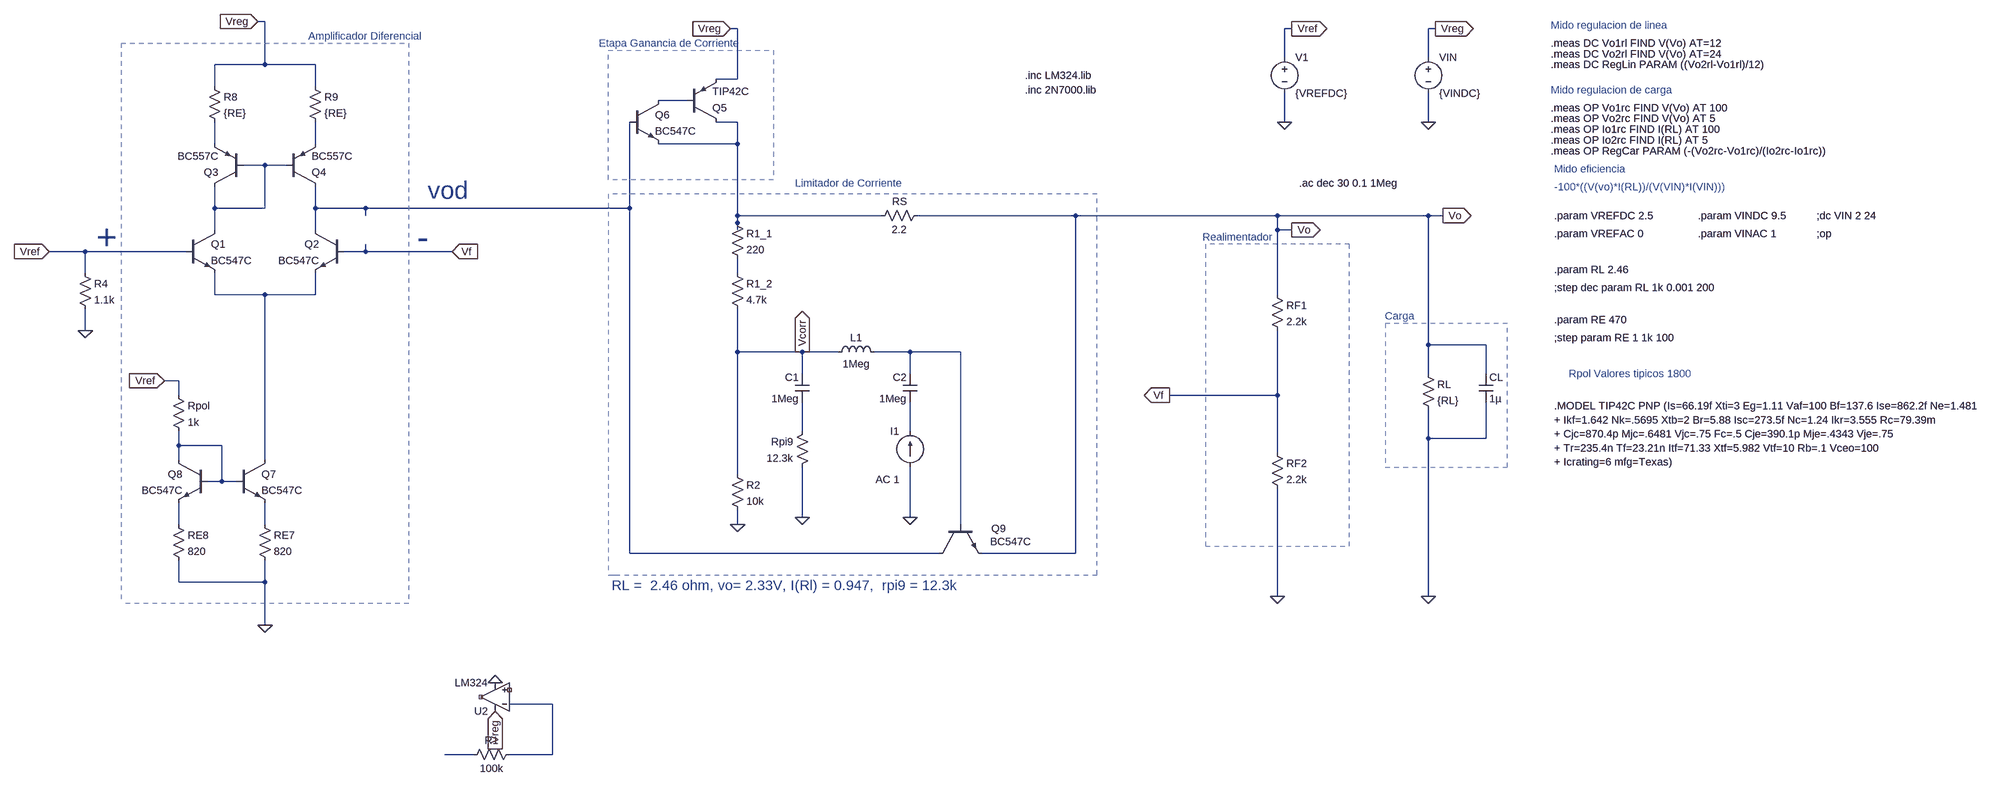
[diagram p0: schematic Ganancia de Lazo de Correo.asc]
Ganancia de Lazo de Correo.asc, the LTspice schematic file:
Version 4
SHEET 1 4240 1456
WIRE 208 -224 192 -224
WIRE 1328 -208 1312 -208
WIRE 2608 -208 2592 -208
WIRE 2928 -208 2912 -208
WIRE 2592 -144 2592 -208
WIRE 2912 -144 2912 -208
WIRE 208 -128 208 -224
WIRE 208 -128 96 -128
WIRE 320 -128 208 -128
WIRE 1328 -96 1328 -208
WIRE 1328 -96 1280 -96
WIRE 96 -80 96 -128
WIRE 320 -80 320 -128
WIRE 1216 -48 1152 -48
WIRE 1328 0 1280 0
WIRE 2592 0 2592 -64
WIRE 2912 0 2912 -64
WIRE 96 48 96 0
WIRE 320 48 320 0
WIRE 1328 48 1328 0
WIRE 1328 48 1152 48
WIRE 208 96 160 96
WIRE 256 96 208 96
WIRE 96 192 96 144
WIRE 208 192 208 96
WIRE 208 192 96 192
WIRE 320 192 320 144
WIRE 432 192 320 192
WIRE 1088 192 1088 0
WIRE 1088 192 432 192
WIRE 432 208 432 192
WIRE 1328 208 1328 48
WIRE 1648 208 1328 208
WIRE 2080 208 1728 208
WIRE 2576 208 2080 208
WIRE 2912 208 2576 208
WIRE 2944 208 2912 208
WIRE 1328 224 1328 208
WIRE 96 240 96 192
WIRE 320 240 320 192
WIRE 1328 240 1328 224
WIRE 2576 240 2576 208
WIRE 2608 240 2576 240
WIRE -192 288 -272 288
WIRE 32 288 -192 288
WIRE 432 288 432 272
WIRE 432 288 384 288
WIRE 624 288 432 288
WIRE -192 336 -192 288
WIRE 1328 336 1328 304
WIRE 96 384 96 336
WIRE 208 384 96 384
WIRE 320 384 320 336
WIRE 320 384 208 384
WIRE 2576 384 2576 240
WIRE -192 464 -192 416
WIRE 2912 496 2912 208
WIRE 3040 496 2912 496
WIRE 1328 512 1328 416
WIRE 1472 512 1328 512
WIRE 1552 512 1472 512
WIRE 1712 512 1632 512
WIRE 1824 512 1712 512
WIRE 1472 560 1472 512
WIRE 1712 560 1712 512
WIRE 2912 560 2912 496
WIRE 3040 560 3040 496
WIRE 16 576 -16 576
WIRE 16 608 16 576
WIRE 2576 608 2576 464
WIRE 2576 608 2336 608
WIRE 1472 688 1472 624
WIRE 1712 688 1712 624
WIRE 2912 704 2912 640
WIRE 3040 704 3040 624
WIRE 3040 704 2912 704
WIRE 16 720 16 688
WIRE 112 720 16 720
WIRE 2576 736 2576 608
WIRE 16 752 16 720
WIRE 208 752 208 384
WIRE 1328 784 1328 512
WIRE 112 800 112 720
WIRE 112 800 80 800
WIRE 144 800 112 800
WIRE 1472 880 1472 768
WIRE 1712 880 1712 768
WIRE 16 896 16 848
WIRE 208 896 208 848
WIRE 1328 896 1328 864
WIRE 1824 896 1824 512
WIRE 1088 960 1088 192
WIRE 1776 960 1088 960
WIRE 2080 960 2080 208
WIRE 2080 960 1872 960
WIRE 16 1024 16 976
WIRE 208 1024 208 976
WIRE 208 1024 16 1024
WIRE 2576 1056 2576 816
WIRE 2912 1056 2912 704
WIRE 208 1120 208 1024
WIRE 848 1296 752 1296
WIRE 672 1408 608 1408
WIRE 848 1408 848 1296
WIRE 848 1408 752 1408
FLAG 2944 208 Vo
IOPIN 2944 208 Out
FLAG 2608 -208 Vref
IOPIN 2608 -208 Out
FLAG 2336 608 Vf
IOPIN 2336 608 Out
FLAG 2592 0 0
FLAG 2928 -208 Vreg
IOPIN 2928 -208 Out
FLAG 2912 1056 0
FLAG 2576 1056 0
FLAG -272 288 Vref
IOPIN -272 288 In
FLAG -16 576 Vref
IOPIN -16 576 In
FLAG 2912 0 0
FLAG 1312 -208 Vreg
IOPIN 1312 -208 In
FLAG 1328 896 0
FLAG -192 464 0
FLAG 192 -224 Vreg
IOPIN 192 -224 In
FLAG 208 1120 0
FLAG 2608 240 Vo
IOPIN 2608 240 Out
FLAG 720 1248 0
FLAG 720 1312 Vreg
IOPIN 720 1312 In
FLAG 624 288 Vf
IOPIN 624 288 In
FLAG 1472 512 Vcorr
IOPIN 1472 512 Out
FLAG 1472 880 0
FLAG 1712 880 0
DATAFLAG 16 288 ""
DATAFLAG 368 192 ""
DATAFLAG 112 192 ""
DATAFLAG 320 32 ""
SYMBOL pnp 1216 0 M180
SYMATTR InstName Q5
SYMATTR Value TIP42C
SYMBOL npn 1088 -48 R0
SYMATTR InstName Q6
SYMATTR Value BC547C
SYMBOL res 2560 368 R0
SYMATTR InstName RF1
SYMATTR Value 2.2k
SYMBOL res 2560 720 R0
SYMATTR InstName RF2
SYMATTR Value 2.2k
SYMBOL res 2896 544 R0
SYMATTR InstName RL
SYMATTR Value {RL}
SYMBOL voltage 2592 -160 R0
WINDOW 123 24 124 Left 2
WINDOW 39 0 0 Left 0
SYMATTR InstName V1
SYMATTR Value {VREFDC}
SYMBOL res 80 -96 R0
SYMATTR InstName R8
SYMATTR Value {RE}
SYMBOL res 304 -96 R0
SYMATTR InstName R9
SYMATTR Value {RE}
SYMBOL cap 3024 560 R0
SYMATTR InstName CL
SYMATTR Value 1µ
SYMBOL voltage 2912 -160 R0
WINDOW 123 24 124 Left 2
WINDOW 39 0 0 Left 0
SYMATTR InstName VIN
SYMATTR Value {VINDC}
SYMBOL npn 144 752 R0
SYMATTR InstName Q7
SYMATTR Value BC547C
SYMBOL npn 80 752 M0
SYMATTR InstName Q8
SYMATTR Value BC547C
SYMBOL res 0 592 R0
SYMATTR InstName Rpol
SYMATTR Value 1k
SYMBOL npn 1776 896 M90
WINDOW 0 9 117 VRight 2
WINDOW 3 38 114 VRight 2
SYMATTR InstName Q9
SYMATTR Value BC547C
SYMBOL res 1744 192 R90
WINDOW 0 0 56 VBottom 2
WINDOW 3 32 56 VTop 2
SYMATTR InstName RS
SYMATTR Value 2.2
SYMBOL res 1312 768 R0
SYMATTR InstName R2
SYMATTR Value 10k
SYMBOL res 1312 208 R0
SYMATTR InstName R1_1
SYMATTR Value 220
SYMBOL res -208 320 R0
SYMATTR InstName R4
SYMATTR Value 1.1k
SYMBOL res 192 880 R0
SYMATTR InstName RE7
SYMATTR Value 820
SYMBOL res 0 880 R0
SYMATTR InstName RE8
SYMATTR Value 820
SYMBOL res 1312 320 R0
SYMATTR InstName R1_2
SYMATTR Value 4.7k
SYMBOL res 1488 672 M0
SYMATTR InstName Rpi9
SYMATTR Value 12.3k
SYMBOL ind 1648 528 M270
WINDOW 0 32 56 VTop 2
WINDOW 3 5 56 VBottom 2
SYMATTR InstName L1
SYMATTR Value 1Meg
SYMBOL cap 1488 560 M0
SYMATTR InstName C1
SYMATTR Value 1Meg
SYMBOL cap 1728 560 M0
SYMATTR InstName C2
SYMATTR Value 1Meg
SYMBOL OpAmps\\opamp2 720 1344 R180
SYMATTR InstName U2
SYMATTR Value LM324
SYMBOL res 768 1392 R90
WINDOW 0 0 56 VBottom 2
WINDOW 3 32 56 VTop 2
SYMATTR InstName R1
SYMATTR Value 100k
SYMBOL npn 32 240 R0
SYMATTR InstName Q1
SYMATTR Value BC547C
SYMBOL npn 384 240 M0
SYMATTR InstName Q2
SYMATTR Value BC547C
SYMBOL pnp 160 144 R180
SYMATTR InstName Q3
SYMATTR Value BC557C
SYMBOL pnp 256 144 M180
SYMATTR InstName Q4
SYMATTR Value BC557C
SYMBOL current 1712 768 R180
WINDOW 0 24 80 Left 2
WINDOW 3 24 0 Left 2
WINDOW 123 24 -28 Left 2
WINDOW 39 0 0 Left 0
SYMATTR InstName I1
SYMATTR Value ""
SYMATTR Value2 AC 1
TEXT 3776 248 Left 2 !;op
TEXT 3512 208 Left 2 !.param VINDC 9.5
TEXT 3512 248 Left 2 !.param VINAC 1
TEXT 3192 208 Left 2 !.param VREFDC 2.5
TEXT 3192 248 Left 2 !.param VREFAC 0
TEXT 3192 328 Left 2 !.param RL 2.46
TEXT 3776 208 Left 2 !;dc VIN 2 24
TEXT 3192 480 Left 2 !;step param RE 1 1k 100
TEXT 3192 440 Left 2 !.param RE 470
TEXT 3192 368 Left 2 !;step dec param RL 1k 0.001 200
TEXT 3184 -216 Left 2 ;Mido regulacion de linea
TEXT 3184 -176 Left 2 !.meas DC Vo1rl FIND V(Vo) AT=12
TEXT 3184 -152 Left 2 !.meas DC Vo2rl FIND V(Vo) AT=24
TEXT 3184 -128 Left 2 !.meas DC RegLin PARAM ((Vo2rl-Vo1rl)/12)
TEXT 3184 -72 Left 2 ;Mido regulacion de carga
TEXT 3184 -32 Left 2 !.meas OP Vo1rc FIND V(Vo) AT 100
TEXT 3184 -8 Left 2 !.meas OP Vo2rc FIND V(Vo) AT 5
TEXT 3184 16 Left 2 !.meas OP Io1rc FIND I(RL) AT 100
TEXT 3184 40 Left 2 !.meas OP Io2rc FIND I(RL) AT 5
TEXT 3192 104 Left 2 ;Mido eficiencia
TEXT 3192 144 Left 2 ;-100*((V(vo)*I(RL))/(V(VIN)*I(VIN)))
TEXT 3184 64 Left 2 !.meas OP RegCar PARAM (-(Vo2rc-Vo1rc)/(Io2rc-Io1rc))
TEXT 3224 560 Left 2 ;Rpol Valores tipicos 1800
TEXT 3192 632 Left 2 !.MODEL TIP42C PNP (Is=66.19f Xti=3 Eg=1.11 Vaf=100 Bf=137.6 Ise=862.2f Ne=1.481  \n+ Ikf=1.642 Nk=.5695 Xtb=2 Br=5.88 Isc=273.5f Nc=1.24 Ikr=3.555 Rc=79.39m  \n+ Cjc=870.4p Mjc=.6481 Vjc=.75 Fc=.5 Cje=390.1p Mje=.4343 Vje=.75  \n+ Tr=235.4n Tf=23.21n Itf=71.33 Xtf=5.982 Vtf=10 Rb=.1 Vceo=100  \n+ Icrating=6 mfg=Texas)
TEXT -144 256 Center 6 ;+
TEXT 560 256 Center 6 ;-
TEXT 616 152 Center 5 ;vod
TEXT 304 -192 Left 2 ;Amplificador Diferencial
TEXT 1176 -176 Center 2 ;Etapa Ganancia de Corriente
TEXT 1576 136 Center 2 ;Limitador de Corriente
TEXT 2488 256 Center 2 ;Realimentador
TEXT 2848 432 Center 2 ;Carga
TEXT 2624 136 Left 2 !.ac dec 30 0.1 1Meg
TEXT 1968 -104 Left 2 !.inc LM324.lib
TEXT 1968 -72 Left 2 !.inc 2N7000.lib
TEXT 1048 1032 Left 3 ;RL =  2.46 ohm, vo= 2.33V, I(Rl) = 0.947,  rpi9 = 12.3k
LINE Normal 528 1072 -112 1072 1
LINE Normal -112 -176 -112 1072 1
LINE Normal 528 -176 528 1072 1
LINE Normal -112 -176 528 -176 1
LINE Normal 1408 128 1040 128 1
LINE Normal 1408 -160 1408 128 1
LINE Normal 1040 -160 1408 -160 1
LINE Normal 1040 128 1040 -160 1
LINE Normal 2128 160 1040 160 1
LINE Normal 2128 1008 2128 160 1
LINE Normal 1056 1008 2128 1008 1
LINE Normal 1040 1008 1056 1008 1
LINE Normal 1040 160 1040 1008 1
LINE Normal 2416 272 2416 592 1
LINE Normal 2416 592 2416 944 1
LINE Normal 2736 272 2416 272 1
LINE Normal 2736 944 2736 272 1
LINE Normal 2416 944 2736 944 1
LINE Normal 3088 448 2816 448 1
LINE Normal 3088 768 3088 448 1
LINE Normal 2816 768 3088 768 1
LINE Normal 2816 448 2816 768 1

The netlist it stands for:
* Ganancia de Lazo de Correo.asc
Q5 N002 N001 Vreg 0 TIP42C
Q6 N001 N006 N002 0 BC547C
RF1 Vo Vf 2.2k
RF2 Vf 0 2.2k
RL Vo 0 {RL}
V1 Vref 0 {VREFDC}
R8 Vreg N003 {RE}
R9 Vreg N004 {RE}
CL Vo 0 1µ
VIN Vreg 0 {VINDC}
Q7 N008 N012 N014 0 BC547C
Q8 N012 N012 N013 0 BC547C
Rpol Vref N012 1k
Q9 N006 N009 Vo 0 BC547C
RS Vo N002 2.2
R2 Vcorr 0 10k
R1_1 N002 N007 220
R4 Vref 0 1.1k
RE7 N014 0 820
RE8 N013 0 820
R1_2 N007 Vcorr 4.7k
Rpi9 N010 0 12.3k
L1 N009 Vcorr 1Meg
C1 Vcorr N010 1Meg
C2 N009 N011 1Meg
XU2 NC_01 N015 Vreg 0 NC_02 LM324  ; pins In+ In- V+ V- OUT
R1 N015 N016 100k
Q1 N005 Vref N008 0 BC547C
Q2 N006 Vf N008 0 BC547C
Q3 N005 N005 N003 0 BC557C
Q4 N006 N005 N004 0 BC557C
I1 0 N011 AC 1
.model NPN NPN
.model PNP PNP
.lib standard.bjt
;op
.param VINDC 9.5
.param VINAC 1
.param VREFDC 2.5
.param VREFAC 0
.param RL 2.46
;dc VIN 2 24
;step param RE 1 1k 100
.param RE 470
;step dec param RL 1k 0.001 200
* Mido regulacion de linea
.meas DC Vo1rl FIND V(Vo) AT=12
.meas DC Vo2rl FIND V(Vo) AT=24
.meas DC RegLin PARAM ((Vo2rl-Vo1rl)/12)
* Mido regulacion de carga
.meas OP Vo1rc FIND V(Vo) AT 100
.meas OP Vo2rc FIND V(Vo) AT 5
.meas OP Io1rc FIND I(RL) AT 100
.meas OP Io2rc FIND I(RL) AT 5
* Mido eficiencia
* -100*((V(vo)*I(RL))/(V(VIN)*I(VIN)))
.meas OP RegCar PARAM (-(Vo2rc-Vo1rc)/(Io2rc-Io1rc))
* Rpol Valores tipicos 1800
.MODEL TIP42C PNP (Is=66.19f Xti=3 Eg=1.11 Vaf=100 Bf=137.6 Ise=862.2f Ne=1.481
+ Ikf=1.642 Nk=.5695 Xtb=2 Br=5.88 Isc=273.5f Nc=1.24 Ikr=3.555 Rc=79.39m
+ Cjc=870.4p Mjc=.6481 Vjc=.75 Fc=.5 Cje=390.1p Mje=.4343 Vje=.75
+ Tr=235.4n Tf=23.21n Itf=71.33 Xtf=5.982 Vtf=10 Rb=.1 Vceo=100
+ Icrating=6 mfg=Texas)
* +
* -
* vod
* Amplificador Diferencial
* Etapa Ganancia de Corriente
* Limitador de Corriente
* Realimentador
* Carga
.ac dec 30 0.1 1Meg
.inc LM324.lib
.inc 2N7000.lib
* RL =  2.46 ohm, vo= 2.33V, I(Rl) = 0.947,  rpi9 = 12.3k
.backanno
.end